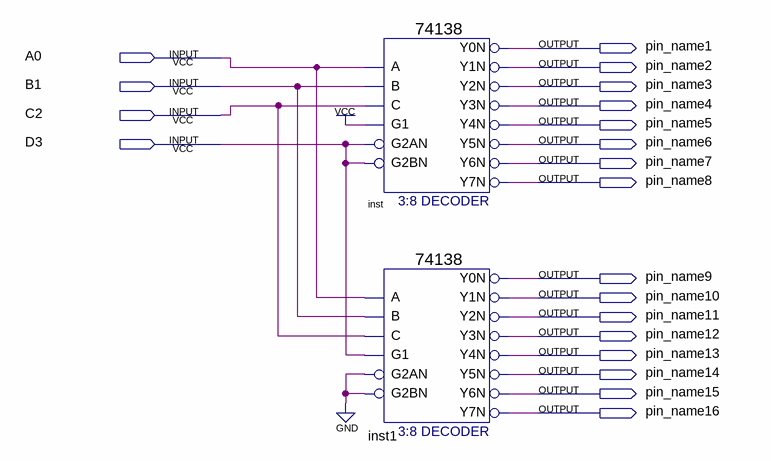
[diagram p0: schematic sheet]
// Quartus schematic 4to16decoder.bdf as structural Verilog: 2 symbols, 20 pins
module \4to16decoder  (
  input  A0,
  input  B1,
  input  C2,
  input  D3,
  output pin_name1,
  output pin_name2,
  output pin_name3,
  output pin_name4,
  output pin_name5,
  output pin_name6,
  output pin_name7,
  output pin_name8,
  output pin_name9,
  output pin_name10,
  output pin_name11,
  output pin_name12,
  output pin_name13,
  output pin_name14,
  output pin_name15,
  output pin_name16
);

  \74138  inst (
    .A(A0), .B(B1), .G1(1'b1), .C(C2), .G2AN(D3), .G2BN(D3), .Y0N(pin_name1), .Y1N(pin_name2),
    .Y2N(pin_name3), .Y3N(pin_name4), .Y4N(pin_name5), .Y5N(pin_name6), .Y6N(pin_name7), .Y7N(pin_name8));
  \74138  inst1 (
    .A(A0), .B(B1), .G1(D3), .C(C2), .G2AN(1'b0), .G2BN(1'b0), .Y0N(pin_name9), .Y1N(pin_name10),
    .Y2N(pin_name11), .Y3N(pin_name12), .Y4N(pin_name13), .Y5N(pin_name14), .Y6N(pin_name15), .Y7N(pin_name16));
endmodule
